# Altium schematic sheet 4_FPGA.SchDoc: AX309  Http://www.heijin.org
size A4; DocumentNumber: 4; SheetNumber: 4; SheetTotal: 7; PageSetup: Record=PageOptions|CenterHorizontal=True|CenterVertical=True|PrintScale=1.00|XCorrection=1.00|YCorrection=1.00|PrintKind=0|BorderSize=5000000|LeftOffset=0|BottomOffset=0|Orientation=2|PaperLength=1000|PaperWidth=1000|Scale=100|PaperSource=7|PrintQuality=-4|MediaType=1|DitherType=10|PrintScaleMode=1|PaperKind=A4|PaperIndex=9
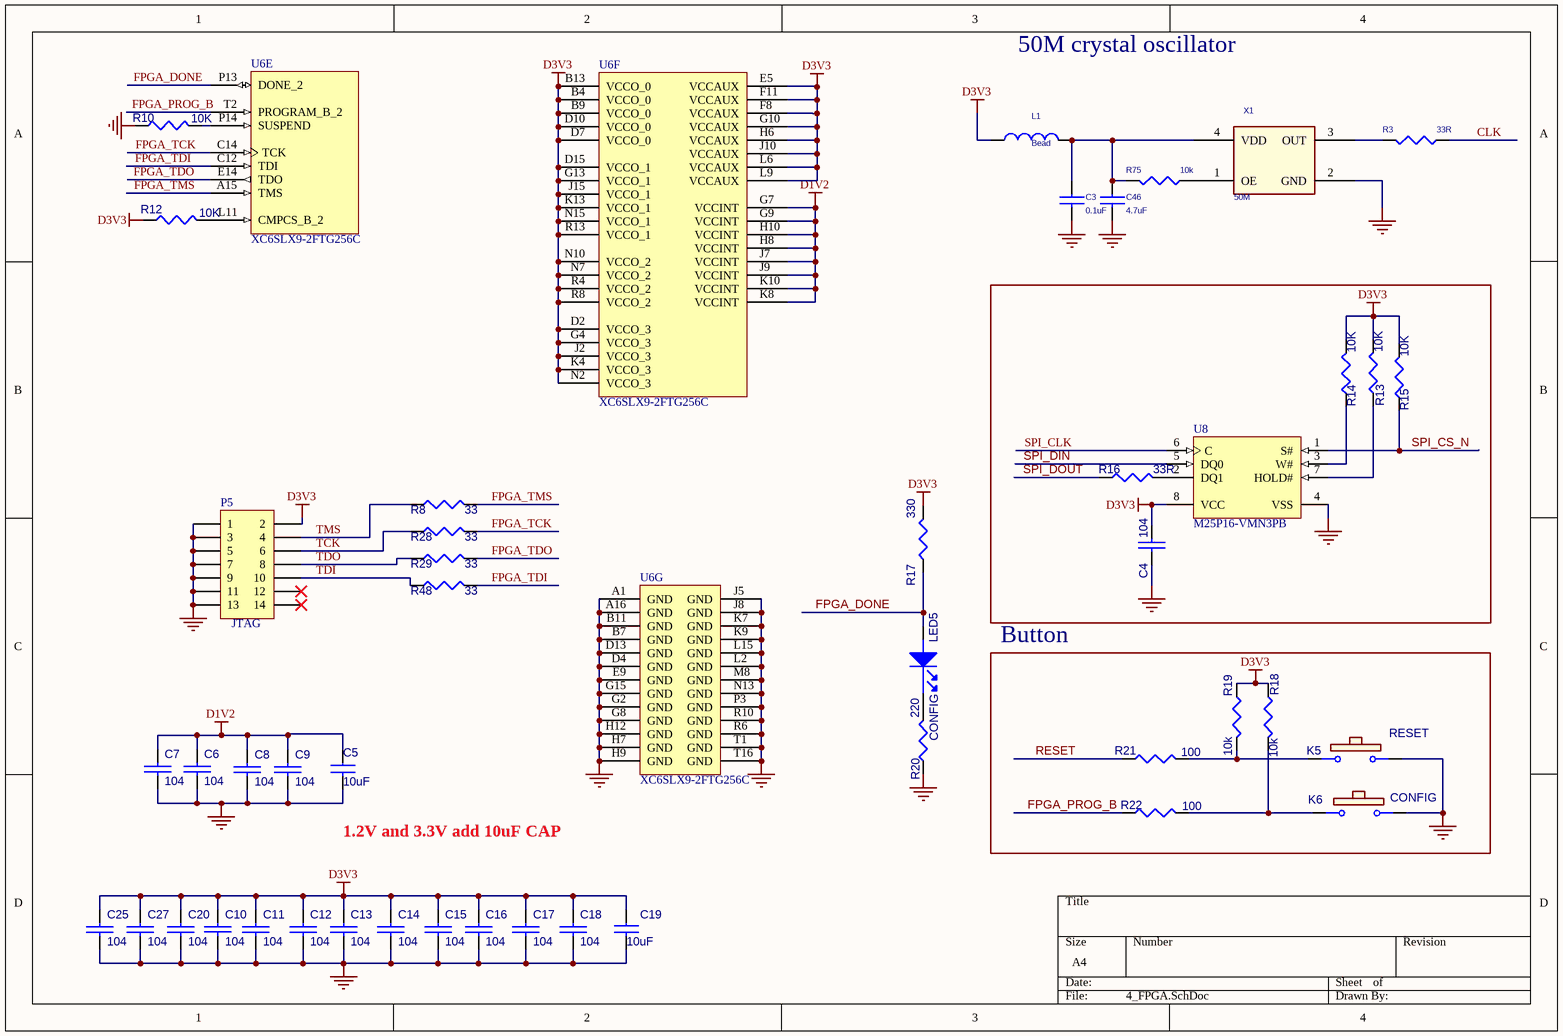
[diagram p0: 4_FPGA.SchDoc]

## Parts
C3  0.1uF  [0402]
C4  104  [0402]
C5  10uF  [0805]
C6  104  [0402]
C7  104  [0402]
C8  104  [0402]
C9  104  [0402]
C10  104  [0402]
C11  104  [0402]
C12  104  [0402]
C13  104  [0402]
C14  104  [0402]
C15  104  [0402]
C16  104  [0402]
C17  104  [0402]
C18  104  [0402]
C19  10uF  [0805]
C20  104  [0402]
C25  104  [0402]
C27  104  [0402]
C46  4.7uF  [0603]
K5  RESET  [KEY735SO]
K6  CONFIG  [KEY735SO]
L1  Bead  [0603]
LED5  CONFIG  [LEDSO]
P5  JTAG  [JTAG14-.5]
R3  33R  [0603]
R8  33  [0603]
R10  10K  [0603]
R12  10K  [0603]
R13  10K  [0603]
R14  10K  [0603]
R15  10K  [0603]
R16  33R  [0603]
R17  330  [0603]
R18  10k  [0603]
R19  10k  [0603]
R20  220  [0603]
R21  100  [0603]
R22  100  [0603]
R28  33  [0603]
R29  33  [0603]
R48  33  [0603]
R75  10k  [0603]
U6  XC6SLX9-2FTG256C  [FTG256]  (parts E,F,G of 7)
U8  M25P16-VMN3PB  [SO8]
X1  50M  [CY_4]

## Blocks framed on the sheet
Button: K5 K6 R18 R19 R21 R22

## Nets
D1V2: C5.1 C6.1 C7.1 C8.1 C9.1 U6.G7(VCCINT) U6.G9(VCCINT) U6.H8(VCCINT) U6.H10(VCCINT) U6.J7(VCCINT) U6.J9(VCCINT) U6.K8(VCCINT) U6.K10(VCCINT)
D3V3: C4.2 C10.1 C11.1 C12.1 C13.1 C14.1 C15.1 C16.1 C17.1 C18.1 C19.1 C20.1 C25.1 C27.1 L1.1 P5.2 R12.1 R13.2 R14.2 R15.2 R17.2 R18.1 R19.1 U6.B4(VCCO_0) U6.B9(VCCO_0) U6.B13(VCCO_0) U6.D2(VCCO_3) U6.D7(VCCO_0) U6.D10(VCCO_0) U6.D15(VCCO_1) U6.E5(VCCAUX) U6.F8(VCCAUX) U6.F11(VCCAUX) U6.G4(VCCO_3) U6.G10(VCCAUX) U6.G13(VCCO_1) U6.H6(VCCAUX) U6.J2(VCCO_3) U6.J10(VCCAUX) U6.J15(VCCO_1) U6.K4(VCCO_3) U6.K13(VCCO_1) U6.L6(VCCAUX) U6.L9(VCCAUX) U6.N2(VCCO_3) U6.N7(VCCO_2) U6.N10(VCCO_2) U6.N15(VCCO_1) U6.R4(VCCO_2) U6.R8(VCCO_2) U6.R13(VCCO_1) U8.8(VCC)
GND: C3.2 C4.1 C5.2 C6.2 C7.2 C8.2 C9.2 C10.2 C11.2 C12.2 C13.2 C14.2 C15.2 C16.2 C17.2 C18.2 C19.2 C20.2 C25.2 C27.2 C46.2 K5.2 K6.1 P5.1 P5.3 P5.5 P5.7 P5.9 P5.11 P5.13 R10.1 R20.1 U6.A1(GND) U6.A16(GND) U6.B7(GND) U6.B11(GND) U6.D4(GND) U6.D13(GND) U6.E9(GND) U6.G2(GND) U6.G8(GND) U6.G15(GND) U6.H7(GND) U6.H9(GND) U6.H12(GND) U6.J5(GND) U6.J8(GND) U6.K7(GND) U6.K9(GND) U6.L2(GND) U6.L15(GND) U6.M8(GND) U6.N13(GND) U6.P3(GND) U6.R6(GND) U6.R10(GND) U6.T1(GND) U6.T16(GND) U8.4(VSS) X1.2(GND)
CLK: R3.1
FPGA_DONE: LED5.1(ANODE) R17.1 U6.P13(DONE_2)
FPGA_PROG_B: R22.1 U6.T2(PROGRAM_B_2)
FPGA_TCK: R28.2 U6.C14(TCK)
FPGA_TDI: R48.2 U6.C12(TDI)
FPGA_TDO: R29.2 U6.E14(TDO)
FPGA_TMS: R8.2 U6.A15(TMS)
RESET: R21.1
SPI_CLK: U8.6(C)
SPI_CS_N: R15.1 U8.1(S#)
SPI_DIN: U8.5(DQ0)
SPI_DOUT: R16.1
TCK: P5.6 R28.1
TDI: P5.10 R48.1
TDO: P5.8 R29.1
TMS: P5.4 R8.1
NetC3_1: C3.1 C46.1 L1.2 R75.2 X1.4(VDD)
NetK5_1: K5.1 R19.2 R21.2
NetK6_2: K6.2 R18.2 R22.2
NetLED5_2: LED5.2(CATHODE) R20.2
NetR3_2: R3.2 X1.3(OUT)
NetR10_2: R10.2 U6.P14(SUSPEND)
NetR12_2: R12.2 U6.L11(CMPCS_B_2)
NetR13_1: R13.1 U8.7(HOLD#)
NetR14_1: R14.1 U8.3(W#)
NetR16_2: R16.2 U8.2(DQ1)
NetR75_1: R75.1 X1.1(OE)

Not connected (* = marked no-connect by the designer): P5 12* 14*

## Notes on the sheet
- 50M crystal oscillator
- 1.2V and 3.3V add 10uF CAP
- Title
- Size:
- Date:
- A4
- Number:
- Time:
- Revision:
- Sheet
- of
- File:

## Library data of the parts
C3 C5 C19 C46 = CAP NP_Dup2
C4 C6-C18 C20 C25 C27 = C_Dup4
K5 K6 = KEYB
L1 = INDUCTOR
LED5 = LED_Dup1
P5 = Header 7X2: Header, 7-Pin, Dual row; LatestRevisionDate: 17-Jul-2002; LatestRevisionNote: Re-released for DXP Platform.; Publisher: Altium Limited
R3 R75 = RESISTOR
R8 R10 R12-R15 R28 R29 R48 = R
R16 = R_Dup3
R17 R20 = R_Dup1
R18 R19 R21 R22 = R_Dup2
U6 = XC6SLX9-2FTG256C: Spartan-6 LX 1.2V FPGA, 186 User I/Os, 256-Ball Fine-Pitch Thin BGA (1.0mm Pitch), Speed Grade 2, Commercial Grade, Pb-Free; DatasheetVersion: ver1.6, Nov-2010; PackageVersion: ver1.3, Oct-2007; PackageReference: FTG256; PackageDescription: 256-Ball Fine Pitch Thin Ball Grid Array 1.00 mm Pitch (FTG256) - Pb-Free; Code_JEDEC: MS-034-AAF-1*; ComponentLink1Description: Manufacturer URL; ComponentLink1URL: http://www.xilinx.com/; ComponentLink2Description: Spartan-6 Datasheet; ComponentLink2URL: http://www.xilinx.com/support/documentation/data_sheets/ds160.pdf; ComponentLink3Description: Spartan-6 Documents; ComponentLink3URL: http://www.xilinx.com/support/documentation/spartan-6.htm
U8 = M25P16-VMN3PB: 16 Mb (x1) Automotive Serial NOR Flash Memory, 75 MHz, 2.7 to 3.6 V, 8-pin SO8 Narrow (MN), Tube; Part Family: M25P爘ISHIDDEN=T; Manufacturer: Micron; Density: 16Mb爘ISHIDDEN=T; Speed: 75 MHz爘ISHIDDEN=T; Voltage: 2.7V-3.6V爘ISHIDDEN=T; DatasheetVersion: Rev. Y; PackageVersion: Rev 11; PackageReference: MICT-MN-8; PackageDescription: 8-Pin SO Narrow, 3.9 X 4.9 mm, Pitch 1.27 mm; Applications: Automotive爘ISHIDDEN=T; Package: SO8 Narrow爘ISHIDDEN=T; Part Status: Production爘ISHIDDEN=T; RoHS: Yes爘ISHIDDEN=T; Type: Data Storage爘ISHIDDEN=T; Width: x1爘ISHIDDEN=T; Mounting Technology: Surface Mount; PartNumber: M25P16-VMN3PB; ComponentLink1Description: Manufacturer URL; ComponentLink1URL: http://www.micron.com/; ComponentLink2Description: Datasheet; ComponentLink2URL: http://www.micron.com/~/media/Documents/Products/Data%20Sheet/NOR%20Flash/Serial%20NOR/M25P/M25P16.pdf; ComponentLink3Description: Package Specification; ComponentLink3URL: http://www.micron.com/~/media/Documents/Products/Data%20Sheet/NOR%20Flash/Serial%20NOR/M25P/M25P05A.pdf
X1 = OSC